# EAGLE schematic IF_TEST_1 (EAGLE 6.5.0)

## Sheet 1 of 6
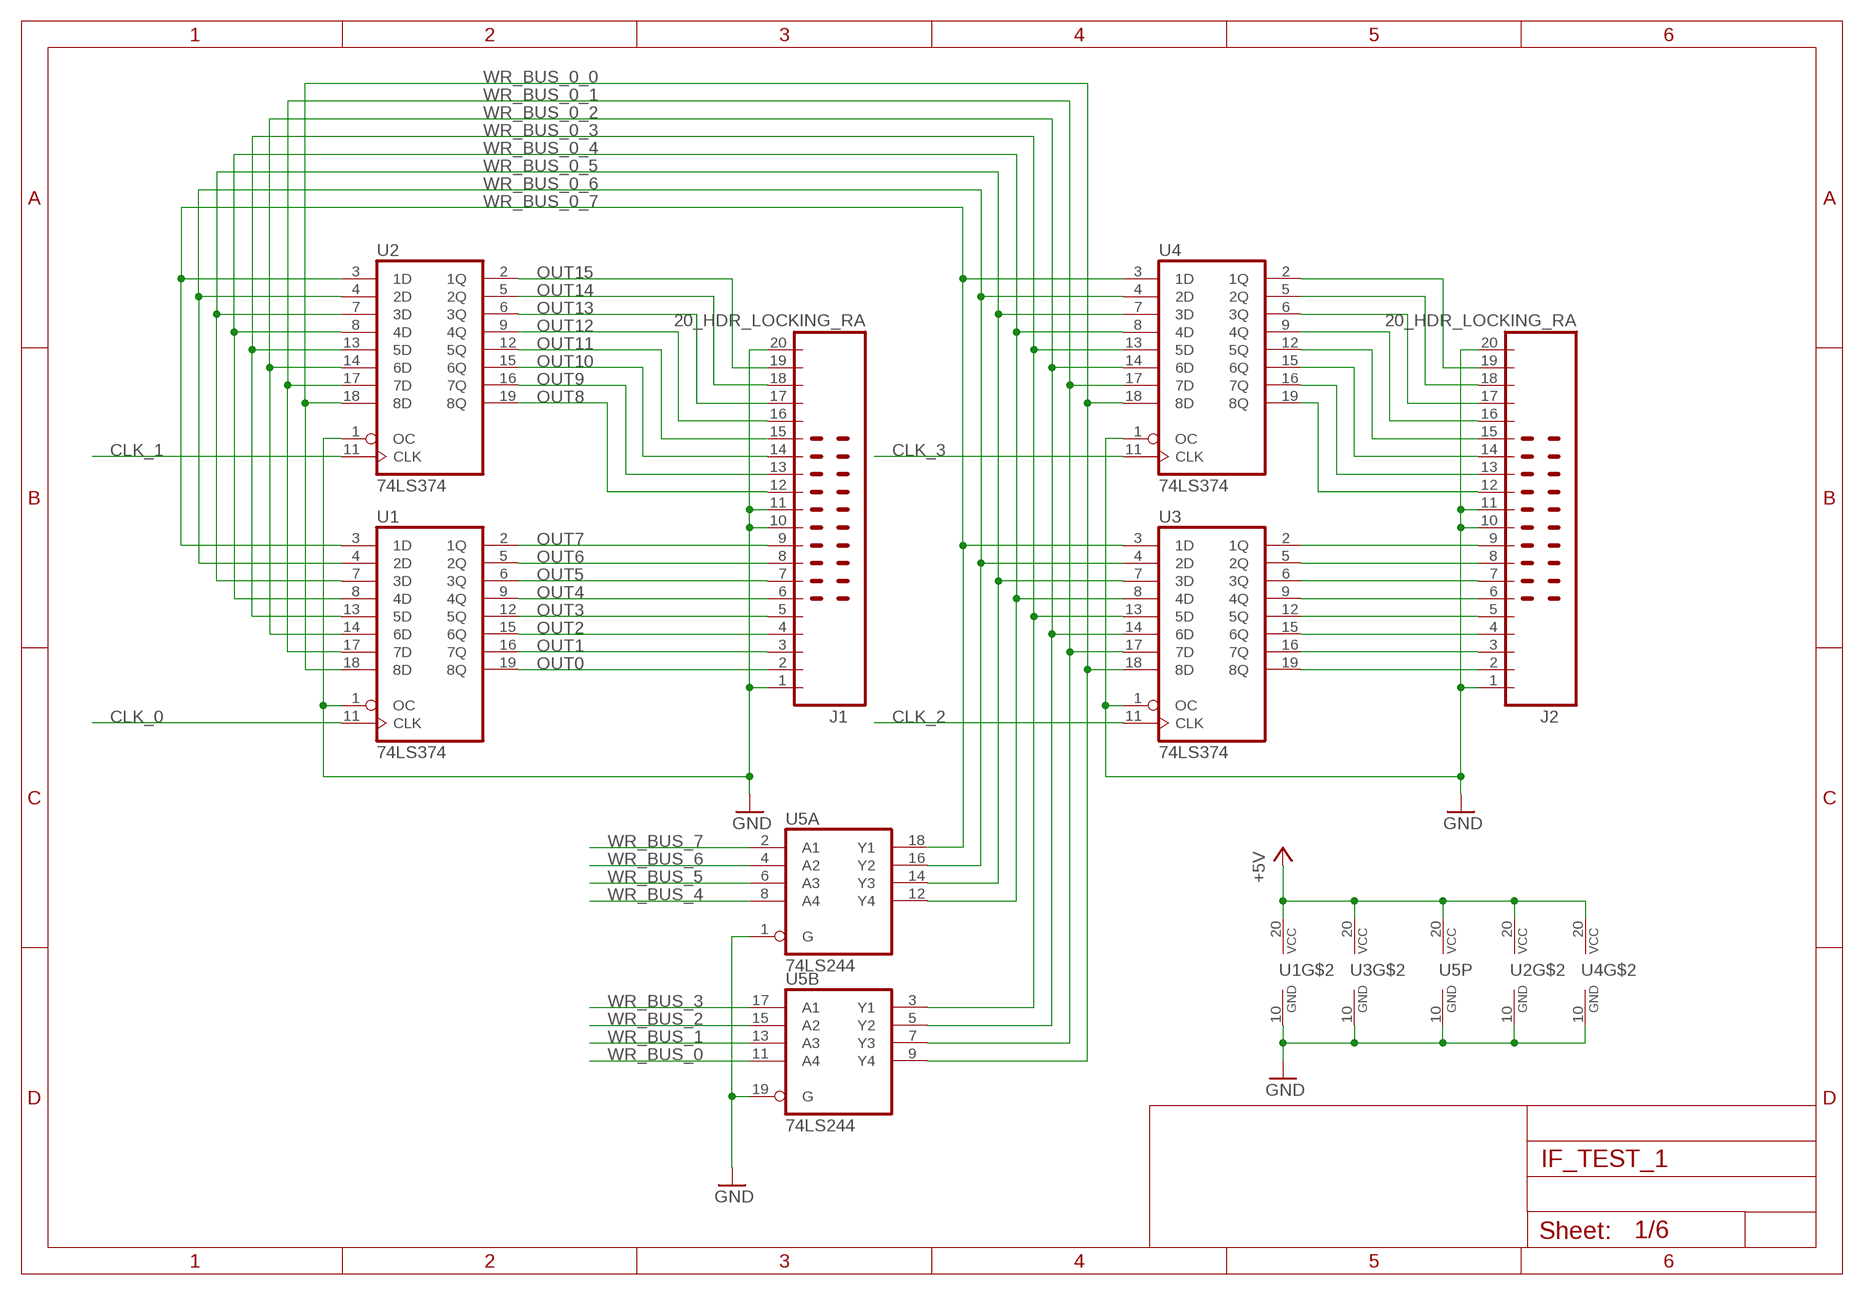
[diagram p0: schematic, sheet 1]

### Parts
J1  20_HDR_LOCKING_RA  [20_HDR_LOCKING_RA]
J2  20_HDR_LOCKING_RA  [20_HDR_LOCKING_RA]
U1  74LS374  [DIP20]
U2  74LS374  [DIP20]
U3  74LS374  [DIP20]
U4  74LS374  [DIP20]
U5  74LS244  [DIP20]

### Nets
+5V: U1.20(VCC) U2.20(VCC) U3.20(VCC) U4.20(VCC) U5.20(P:VCC) ; also sheet 2,3,4,5,6
CLK_0: U1.11(CLK) ; also sheet 5
CLK_1: U2.11(CLK) ; also sheet 5
CLK_2: U3.11(CLK) ; also sheet 5
CLK_3: U4.11(CLK) ; also sheet 5
GND: J1.1 J1.10 J1.11 J1.20 J2.1 J2.10 J2.11 J2.20 U1.1(OC) U1.10(GND) U2.1(OC) U2.10(GND) U3.1(OC) U3.10(GND) U4.1(OC) U4.10(GND) U5.1(A:G) U5.10(P:GND) U5.19(B:G) ; also sheet 2,3,4,5,6
N$1: J2.2 U3.19(8Q)
N$18: J2.3 U3.16(7Q)
N$19: J2.4 U3.15(6Q)
N$20: J2.5 U3.12(5Q)
N$21: J2.6 U3.9(4Q)
N$22: J2.7 U3.6(3Q)
N$23: J2.8 U3.5(2Q)
N$24: J2.9 U3.2(1Q)
N$27: J2.12 U4.19(8Q)
N$28: J2.13 U4.16(7Q)
N$29: J2.14 U4.15(6Q)
N$30: J2.15 U4.12(5Q)
N$31: J2.16 U4.9(4Q)
N$32: J2.17 U4.6(3Q)
N$33: J2.18 U4.5(2Q)
N$34: J2.19 U4.2(1Q)
OUT0: J1.2 U1.19(8Q)
OUT1: J1.3 U1.16(7Q)
OUT2: J1.4 U1.15(6Q)
OUT3: J1.5 U1.12(5Q)
OUT4: J1.6 U1.9(4Q)
OUT5: J1.7 U1.6(3Q)
OUT6: J1.8 U1.5(2Q)
OUT7: J1.9 U1.2(1Q)
OUT8: J1.12 U2.19(8Q)
OUT9: J1.13 U2.16(7Q)
OUT10: J1.14 U2.15(6Q)
OUT11: J1.15 U2.12(5Q)
OUT12: J1.16 U2.9(4Q)
OUT13: J1.17 U2.6(3Q)
OUT14: J1.18 U2.5(2Q)
OUT15: J1.19 U2.2(1Q)
WR_BUS_0: U5.11(B:A4) ; also sheet 4,6
WR_BUS_0_0: U1.18(8D) U2.18(8D) U3.18(8D) U4.18(8D) U5.9(B:Y4) ; also sheet 2
WR_BUS_0_1: U1.17(7D) U2.17(7D) U3.17(7D) U4.17(7D) U5.7(B:Y3) ; also sheet 2
WR_BUS_0_2: U1.14(6D) U2.14(6D) U3.14(6D) U4.14(6D) U5.5(B:Y2) ; also sheet 2
WR_BUS_0_3: U1.13(5D) U2.13(5D) U3.13(5D) U4.13(5D) U5.3(B:Y1) ; also sheet 2
WR_BUS_0_4: U1.8(4D) U2.8(4D) U3.8(4D) U4.8(4D) U5.12(A:Y4) ; also sheet 2
WR_BUS_0_5: U1.7(3D) U2.7(3D) U3.7(3D) U4.7(3D) U5.14(A:Y3) ; also sheet 2
WR_BUS_0_6: U1.4(2D) U2.4(2D) U3.4(2D) U4.4(2D) U5.16(A:Y2) ; also sheet 2
WR_BUS_0_7: U1.3(1D) U2.3(1D) U3.3(1D) U4.3(1D) U5.18(A:Y1) ; also sheet 2
WR_BUS_1: U5.13(B:A3) ; also sheet 4,6
WR_BUS_2: U5.15(B:A2) ; also sheet 4,6
WR_BUS_3: U5.17(B:A1) ; also sheet 4,6
WR_BUS_4: U5.8(A:A4) ; also sheet 4,6
WR_BUS_5: U5.6(A:A3) ; also sheet 4,6
WR_BUS_6: U5.4(A:A2) ; also sheet 4,6
WR_BUS_7: U5.2(A:A1) ; also sheet 4,6

## Sheet 2 of 6
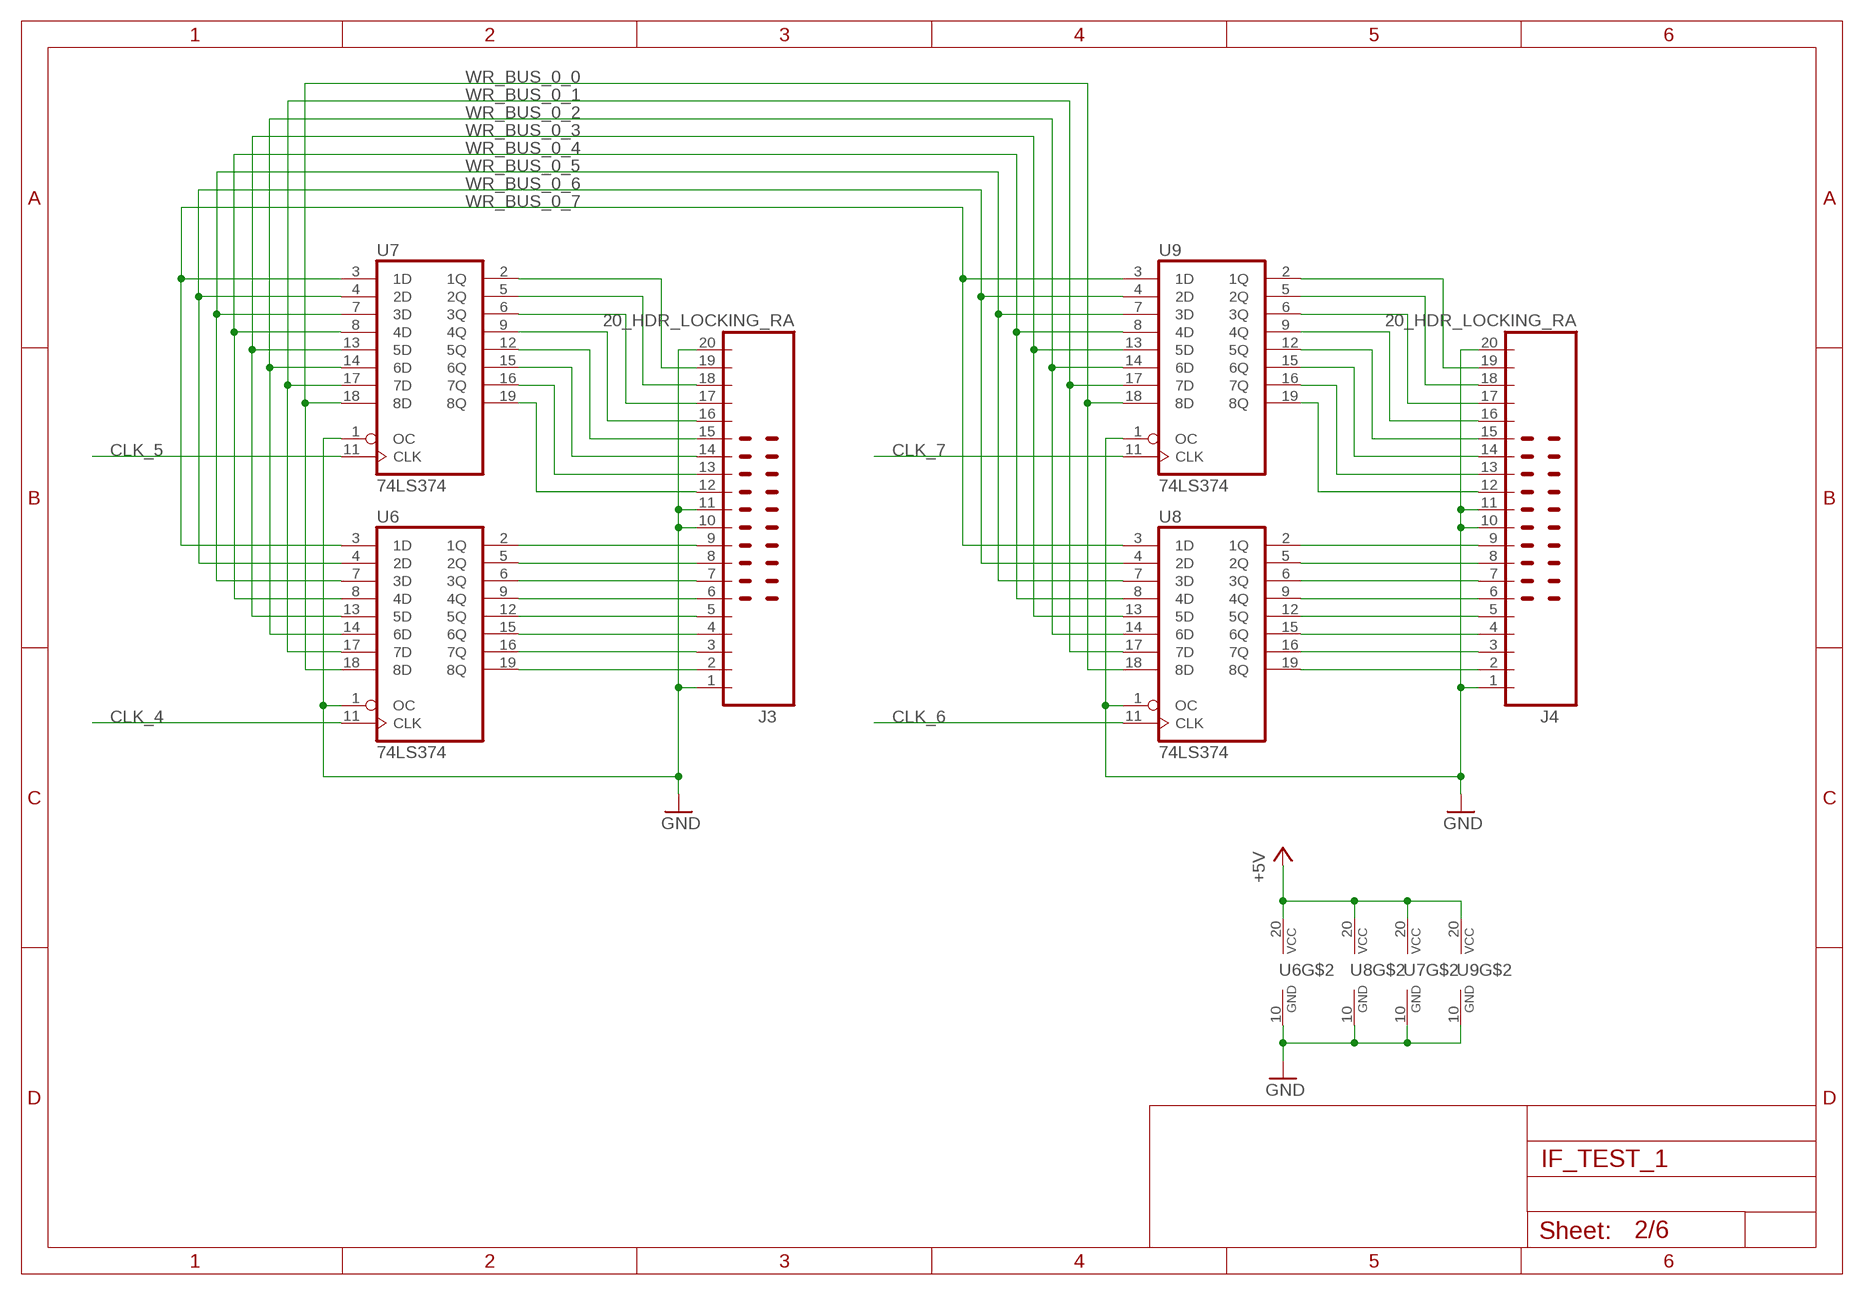
[diagram p1: schematic, sheet 2]

### Parts
J3  20_HDR_LOCKING_RA  [20_HDR_LOCKING_RA]
J4  20_HDR_LOCKING_RA  [20_HDR_LOCKING_RA]
U6  74LS374  [DIP20]
U7  74LS374  [DIP20]
U8  74LS374  [DIP20]
U9  74LS374  [DIP20]

### Nets
+5V: U6.20(VCC) U7.20(VCC) U8.20(VCC) U9.20(VCC) ; also sheet 1,3,4,5,6
CLK_4: U6.11(CLK) ; also sheet 5
CLK_5: U7.11(CLK) ; also sheet 5
CLK_6: U8.11(CLK) ; also sheet 5
CLK_7: U9.11(CLK) ; also sheet 5
GND: J3.1 J3.10 J3.11 J3.20 J4.1 J4.10 J4.11 J4.20 U6.1(OC) U6.10(GND) U7.1(OC) U7.10(GND) U8.1(OC) U8.10(GND) U9.1(OC) U9.10(GND) ; also sheet 1,3,4,5,6
N$25: J3.2 U6.19(8Q)
N$26: J3.3 U6.16(7Q)
N$35: J3.4 U6.15(6Q)
N$36: J3.5 U6.12(5Q)
N$37: J3.6 U6.9(4Q)
N$38: J3.7 U6.6(3Q)
N$39: J3.8 U6.5(2Q)
N$40: J3.9 U6.2(1Q)
N$41: J3.12 U7.19(8Q)
N$42: J3.13 U7.16(7Q)
N$43: J3.14 U7.15(6Q)
N$44: J3.15 U7.12(5Q)
N$45: J3.16 U7.9(4Q)
N$46: J3.17 U7.6(3Q)
N$47: J3.18 U7.5(2Q)
N$48: J3.19 U7.2(1Q)
N$49: J4.2 U8.19(8Q)
N$50: J4.3 U8.16(7Q)
N$51: J4.4 U8.15(6Q)
N$52: J4.5 U8.12(5Q)
N$53: J4.6 U8.9(4Q)
N$54: J4.7 U8.6(3Q)
N$55: J4.8 U8.5(2Q)
N$56: J4.9 U8.2(1Q)
N$57: J4.12 U9.19(8Q)
N$58: J4.13 U9.16(7Q)
N$59: J4.14 U9.15(6Q)
N$60: J4.15 U9.12(5Q)
N$61: J4.16 U9.9(4Q)
N$62: J4.17 U9.6(3Q)
N$63: J4.18 U9.5(2Q)
N$64: J4.19 U9.2(1Q)
WR_BUS_0_0: U6.18(8D) U7.18(8D) U8.18(8D) U9.18(8D) ; also sheet 1
WR_BUS_0_1: U6.17(7D) U7.17(7D) U8.17(7D) U9.17(7D) ; also sheet 1
WR_BUS_0_2: U6.14(6D) U7.14(6D) U8.14(6D) U9.14(6D) ; also sheet 1
WR_BUS_0_3: U6.13(5D) U7.13(5D) U8.13(5D) U9.13(5D) ; also sheet 1
WR_BUS_0_4: U6.8(4D) U7.8(4D) U8.8(4D) U9.8(4D) ; also sheet 1
WR_BUS_0_5: U6.7(3D) U7.7(3D) U8.7(3D) U9.7(3D) ; also sheet 1
WR_BUS_0_6: U6.4(2D) U7.4(2D) U8.4(2D) U9.4(2D) ; also sheet 1
WR_BUS_0_7: U6.3(1D) U7.3(1D) U8.3(1D) U9.3(1D) ; also sheet 1

## Sheet 3 of 6
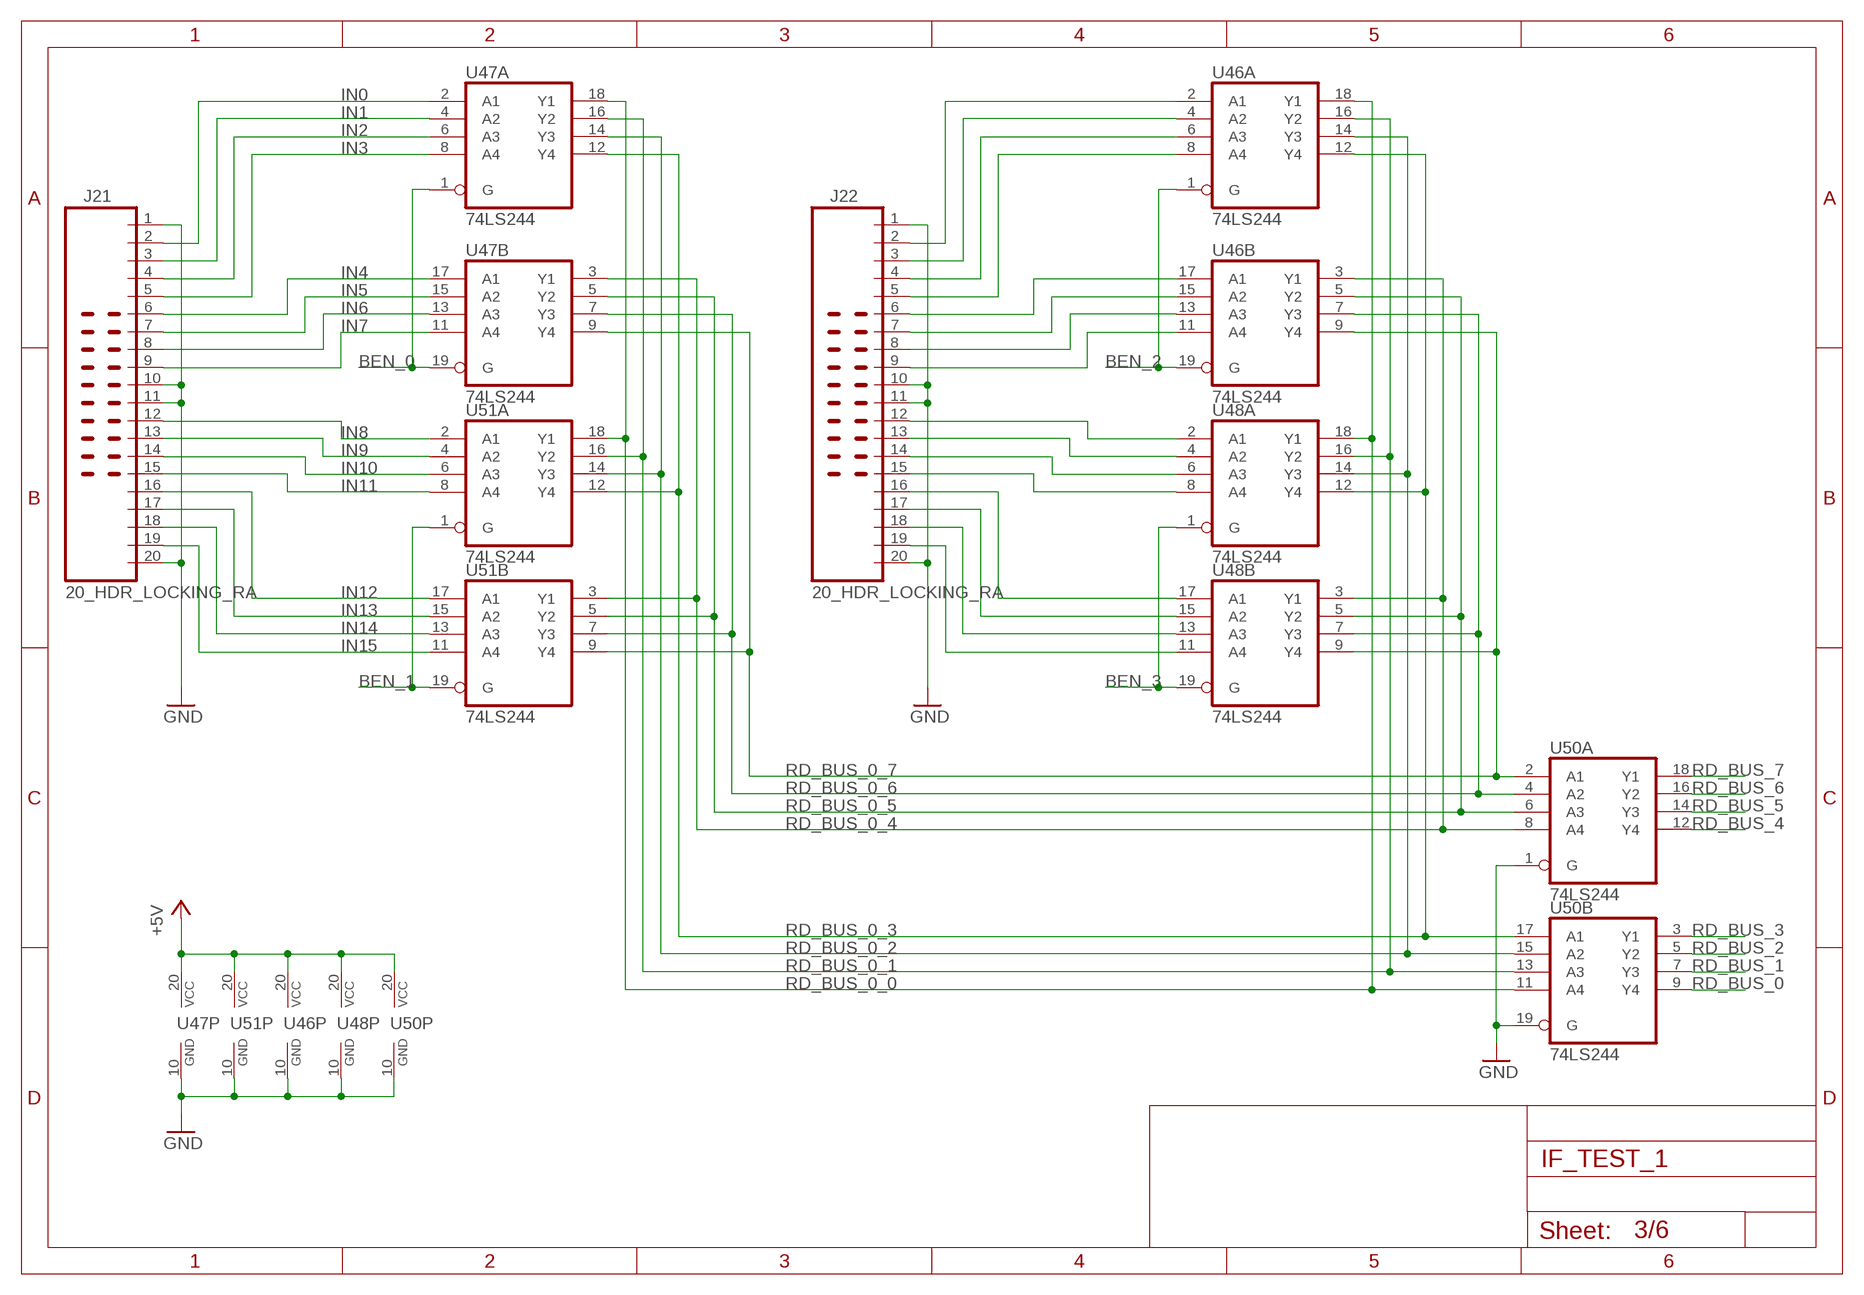
[diagram p2: schematic, sheet 3]

### Parts
J21  20_HDR_LOCKING_RA  [20_HDR_LOCKING_RA]
J22  20_HDR_LOCKING_RA  [20_HDR_LOCKING_RA]
U46  74LS244  [DIP20]
U47  74LS244  [DIP20]
U48  74LS244  [DIP20]
U50  74LS244  [DIP20]
U51  74LS244  [DIP20]

### Nets
+5V: U46.20(P:VCC) U47.20(P:VCC) U48.20(P:VCC) U50.20(P:VCC) U51.20(P:VCC) ; also sheet 1,2,4,5,6
BEN_0: U47.1(A:G) U47.19(B:G) ; also sheet 5
BEN_1: U51.1(A:G) U51.19(B:G) ; also sheet 5
BEN_2: U46.1(A:G) U46.19(B:G) ; also sheet 5
BEN_3: U48.1(A:G) U48.19(B:G) ; also sheet 5
GND: J21.1 J21.10 J21.11 J21.20 J22.1 J22.10 J22.11 J22.20 U46.10(P:GND) U47.10(P:GND) U48.10(P:GND) U50.1(A:G) U50.10(P:GND) U50.19(B:G) U51.10(P:GND) ; also sheet 1,2,4,5,6
IN0: J21.2 U47.2(A:A1)
IN1: J21.3 U47.4(A:A2)
IN2: J21.4 U47.6(A:A3)
IN3: J21.5 U47.8(A:A4)
IN4: J21.6 U47.17(B:A1)
IN5: J21.7 U47.15(B:A2)
IN6: J21.8 U47.13(B:A3)
IN7: J21.9 U47.11(B:A4)
IN8: J21.12 U51.2(A:A1)
IN9: J21.13 U51.4(A:A2)
IN10: J21.14 U51.6(A:A3)
IN11: J21.15 U51.8(A:A4)
IN12: J21.16 U51.17(B:A1)
IN13: J21.17 U51.15(B:A2)
IN14: J21.18 U51.13(B:A3)
IN15: J21.19 U51.11(B:A4)
N$321: J22.2 U46.2(A:A1)
N$330: J22.3 U46.4(A:A2)
N$331: J22.4 U46.6(A:A3)
N$336: J22.5 U46.8(A:A4)
N$345: J22.6 U46.17(B:A1)
N$346: J22.7 U46.15(B:A2)
N$347: J22.8 U46.13(B:A3)
N$348: J22.9 U46.11(B:A4)
N$349: J22.12 U48.2(A:A1)
N$350: J22.13 U48.4(A:A2)
N$351: J22.14 U48.6(A:A3)
N$352: J22.15 U48.8(A:A4)
N$357: J22.19 U48.11(B:A4)
N$358: J22.18 U48.13(B:A3)
N$359: J22.17 U48.15(B:A2)
N$360: J22.16 U48.17(B:A1)
RD_BUS_0: U50.9(B:Y4) ; also sheet 4
RD_BUS_0_0: U46.18(A:Y1) U47.18(A:Y1) U48.18(A:Y1) U50.11(B:A4) U51.18(A:Y1) ; also sheet 6
RD_BUS_0_1: U46.16(A:Y2) U47.16(A:Y2) U48.16(A:Y2) U50.13(B:A3) U51.16(A:Y2) ; also sheet 6
RD_BUS_0_2: U46.14(A:Y3) U47.14(A:Y3) U48.14(A:Y3) U50.15(B:A2) U51.14(A:Y3) ; also sheet 6
RD_BUS_0_3: U46.12(A:Y4) U47.12(A:Y4) U48.12(A:Y4) U50.17(B:A1) U51.12(A:Y4) ; also sheet 6
RD_BUS_0_4: U46.3(B:Y1) U47.3(B:Y1) U48.3(B:Y1) U50.8(A:A4) U51.3(B:Y1) ; also sheet 6
RD_BUS_0_5: U46.5(B:Y2) U47.5(B:Y2) U48.5(B:Y2) U50.6(A:A3) U51.5(B:Y2) ; also sheet 6
RD_BUS_0_6: U46.7(B:Y3) U47.7(B:Y3) U48.7(B:Y3) U50.4(A:A2) U51.7(B:Y3) ; also sheet 6
RD_BUS_0_7: U46.9(B:Y4) U47.9(B:Y4) U48.9(B:Y4) U50.2(A:A1) U51.9(B:Y4) ; also sheet 6
RD_BUS_1: U50.7(B:Y3) ; also sheet 4
RD_BUS_2: U50.5(B:Y2) ; also sheet 4
RD_BUS_3: U50.3(B:Y1) ; also sheet 4
RD_BUS_4: U50.12(A:Y4) ; also sheet 4
RD_BUS_5: U50.14(A:Y3) ; also sheet 4
RD_BUS_6: U50.16(A:Y2) ; also sheet 4
RD_BUS_7: U50.18(A:Y1) ; also sheet 4

## Sheet 4 of 6
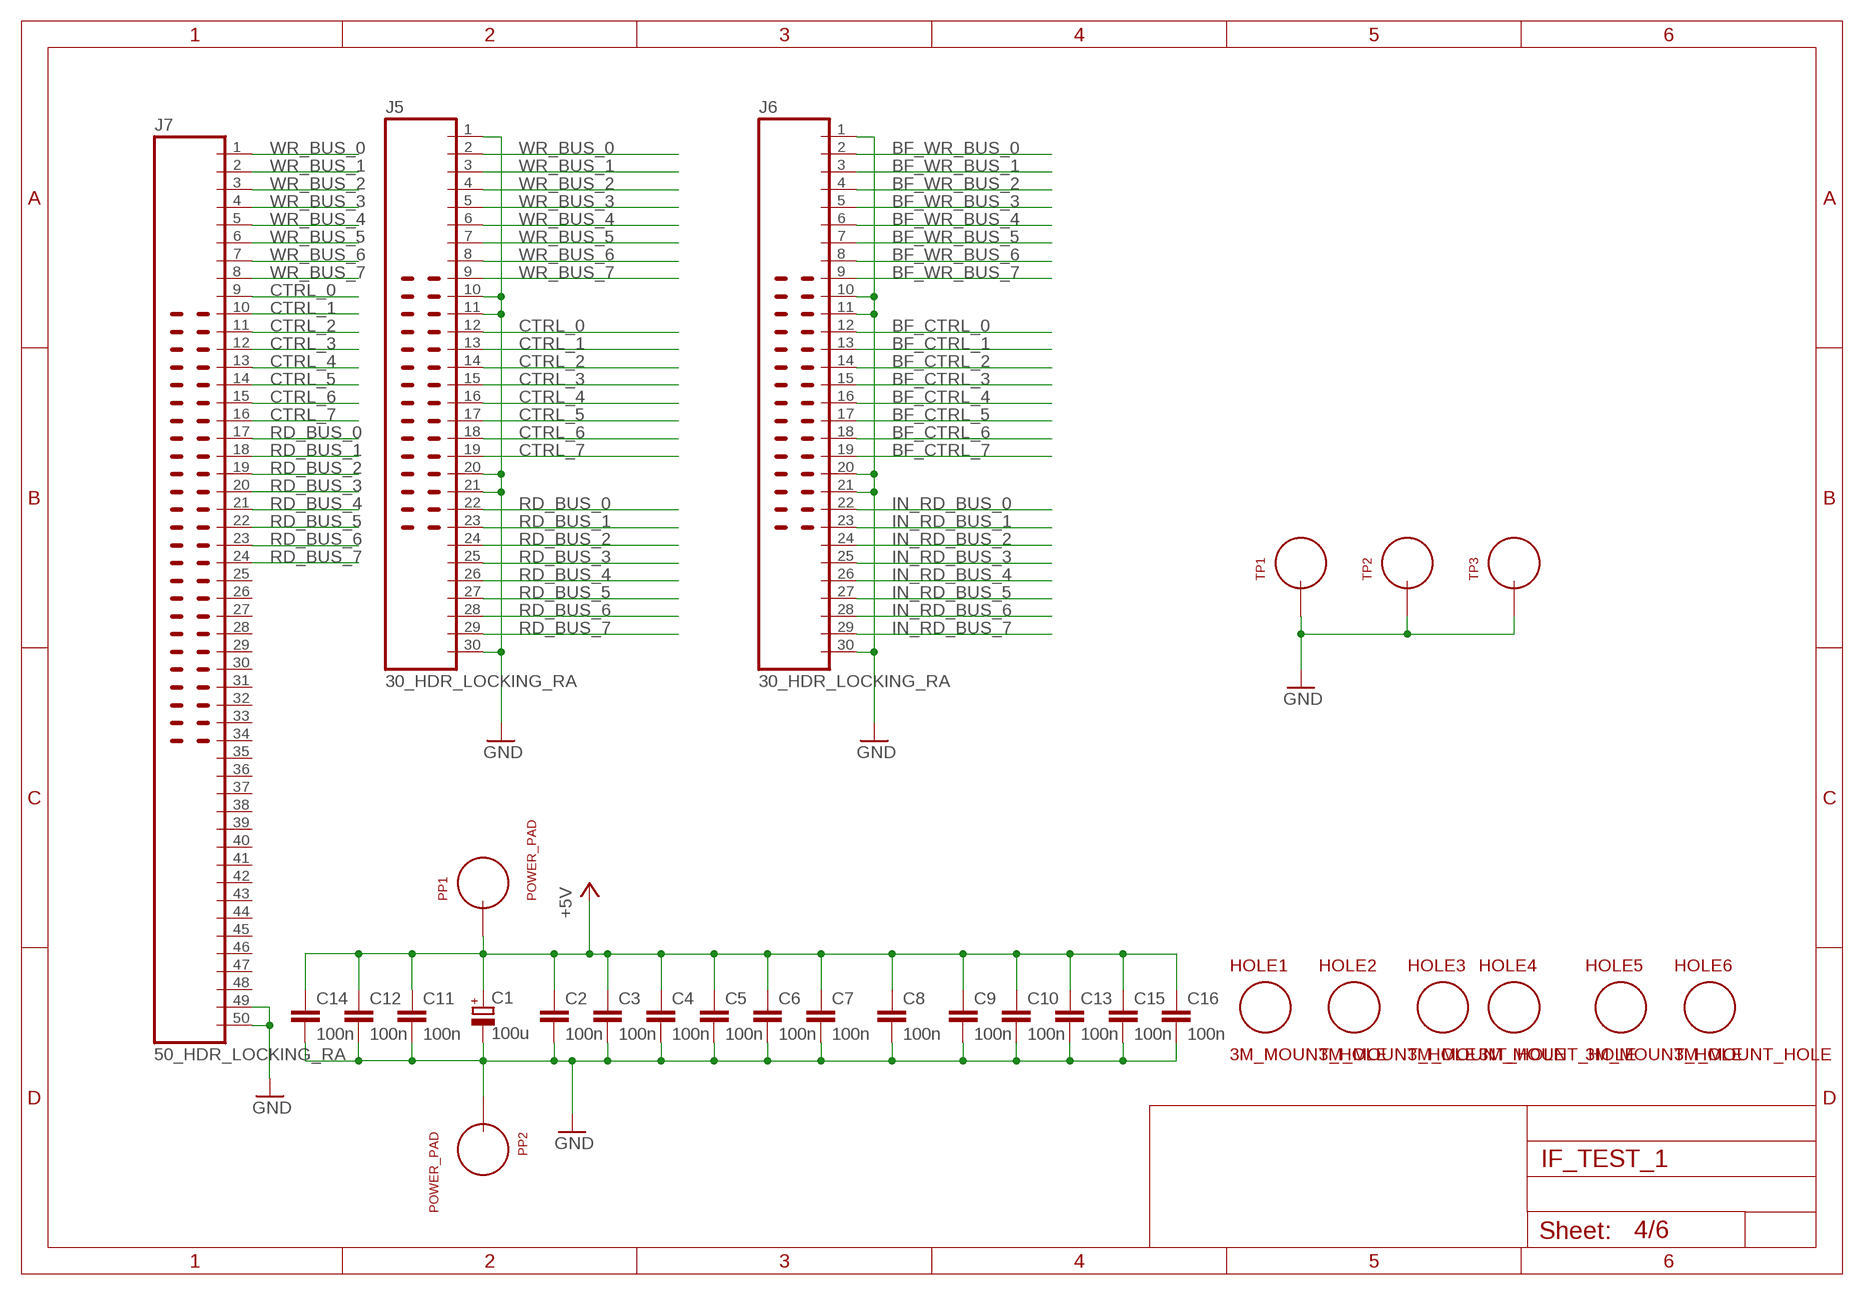
[diagram p3: schematic, sheet 4]

### Parts
C1  100u  POLARISED_CAP_2P5_6P3MM  [POLARISED_CAP_2P5_6P3MM]
C2  100n  C_P2INCH  [CAP_P2INCH]
C3  100n  C_P2INCH  [CAP_P2INCH]
C4  100n  C_P2INCH  [CAP_P2INCH]
C5  100n  C_P2INCH  [CAP_P2INCH]
C6  100n  C_P2INCH  [CAP_P2INCH]
C7  100n  C_P2INCH  [CAP_P2INCH]
C8  100n  C_P2INCH  [CAP_P2INCH]
C9  100n  C_P2INCH  [CAP_P2INCH]
C10  100n  C_P2INCH  [CAP_P2INCH]
C11  100n  C_P2INCH  [CAP_P2INCH]
C12  100n  C_P2INCH  [CAP_P2INCH]
C13  100n  C_P2INCH  [CAP_P2INCH]
C14  100n  C_P2INCH  [CAP_P2INCH]
C15  100n  C_P2INCH  [CAP_P2INCH]
C16  100n  C_P2INCH  [CAP_P2INCH]
HOLE1  3M_MOUNT_HOLE  [3M_HOLE]
HOLE2  3M_MOUNT_HOLE  [3M_HOLE]
HOLE3  3M_MOUNT_HOLE  [3M_HOLE]
HOLE4  3M_MOUNT_HOLE  [3M_HOLE]
HOLE5  3M_MOUNT_HOLE  [3M_HOLE]
HOLE6  3M_MOUNT_HOLE  [3M_HOLE]
J5  30_HDR_LOCKING_RA  [30_HDR_LOCKING_RA]
J6  30_HDR_LOCKING_RA  [30_HDR_LOCKING_RA]
J7  50_HDR_LOCKING_RA  [50_HDR_LOCKING_RA]
PP1  POWER_PAD  [POWER_PAD]
PP2  POWER_PAD  [POWER_PAD]
TP1  TEST_LOOP  [TEST_LOOP]
TP2  TEST_LOOP  [TEST_LOOP]
TP3  TEST_LOOP  [TEST_LOOP]

### Nets
+5V: C1.A C2.1 C3.1 C4.1 C5.1 C6.1 C7.1 C8.1 C9.1 C10.1 C11.1 C12.1 C13.1 C14.1 C15.1 C16.1 PP1.1 ; also sheet 1,2,3,5,6
BF_CTRL_0: J6.12 ; also sheet 6
BF_CTRL_1: J6.13 ; also sheet 6
BF_CTRL_2: J6.14 ; also sheet 6
BF_CTRL_3: J6.15 ; also sheet 6
BF_CTRL_4: J6.16 ; also sheet 6
BF_CTRL_5: J6.17 ; also sheet 6
BF_CTRL_6: J6.18 ; also sheet 6
BF_CTRL_7: J6.19 ; also sheet 6
BF_WR_BUS_0: J6.2 ; also sheet 6
BF_WR_BUS_1: J6.3 ; also sheet 6
BF_WR_BUS_2: J6.4 ; also sheet 6
BF_WR_BUS_3: J6.5 ; also sheet 6
BF_WR_BUS_4: J6.6 ; also sheet 6
BF_WR_BUS_5: J6.7 ; also sheet 6
BF_WR_BUS_6: J6.8 ; also sheet 6
BF_WR_BUS_7: J6.9 ; also sheet 6
CTRL_0: J5.12 J7.9 ; also sheet 5,6
CTRL_1: J5.13 J7.10 ; also sheet 5,6
CTRL_2: J5.14 J7.11 ; also sheet 5,6
CTRL_3: J5.15 J7.12 ; also sheet 5,6
CTRL_4: J5.16 J7.13 ; also sheet 5,6
CTRL_5: J5.17 J7.14 ; also sheet 5,6
CTRL_6: J5.18 J7.15 ; also sheet 5,6
CTRL_7: J5.19 J7.16 ; also sheet 6
GND: C1.K C2.2 C3.2 C4.2 C5.2 C6.2 C7.2 C8.2 C9.2 C10.2 C11.2 C12.2 C13.2 C14.2 C15.2 C16.2 J5.1 J5.10 J5.11 J5.20 J5.21 J5.30 J6.1 J6.10 J6.11 J6.20 J6.21 J6.30 J7.49 J7.50 PP2.1 TP1.P$1 TP2.P$1 TP3.P$1 ; also sheet 1,2,3,5,6
IN_RD_BUS_0: J6.22 ; also sheet 6
IN_RD_BUS_1: J6.23 ; also sheet 6
IN_RD_BUS_2: J6.24 ; also sheet 6
IN_RD_BUS_3: J6.25 ; also sheet 6
IN_RD_BUS_4: J6.26 ; also sheet 6
IN_RD_BUS_5: J6.27 ; also sheet 6
IN_RD_BUS_6: J6.28 ; also sheet 6
IN_RD_BUS_7: J6.29 ; also sheet 6
RD_BUS_0: J5.22 J7.17 ; also sheet 3
RD_BUS_1: J5.23 J7.18 ; also sheet 3
RD_BUS_2: J5.24 J7.19 ; also sheet 3
RD_BUS_3: J5.25 J7.20 ; also sheet 3
RD_BUS_4: J5.26 J7.21 ; also sheet 3
RD_BUS_5: J5.27 J7.22 ; also sheet 3
RD_BUS_6: J5.28 J7.23 ; also sheet 3
RD_BUS_7: J5.29 J7.24 ; also sheet 3
WR_BUS_0: J5.2 J7.1 ; also sheet 1,6
WR_BUS_1: J5.3 J7.2 ; also sheet 1,6
WR_BUS_2: J5.4 J7.3 ; also sheet 1,6
WR_BUS_3: J5.5 J7.4 ; also sheet 1,6
WR_BUS_4: J5.6 J7.5 ; also sheet 1,6
WR_BUS_5: J5.7 J7.6 ; also sheet 1,6
WR_BUS_6: J5.8 J7.7 ; also sheet 1,6
WR_BUS_7: J5.9 J7.8 ; also sheet 1,6
Unconnected: J7.25 J7.26 J7.27 J7.28 J7.29 J7.30 J7.31 J7.32 J7.33 J7.34 J7.35 J7.36 J7.37 J7.38 J7.39 J7.40 J7.41 J7.42 J7.43 J7.44 J7.45 J7.46 J7.47 J7.48

## Sheet 5 of 6
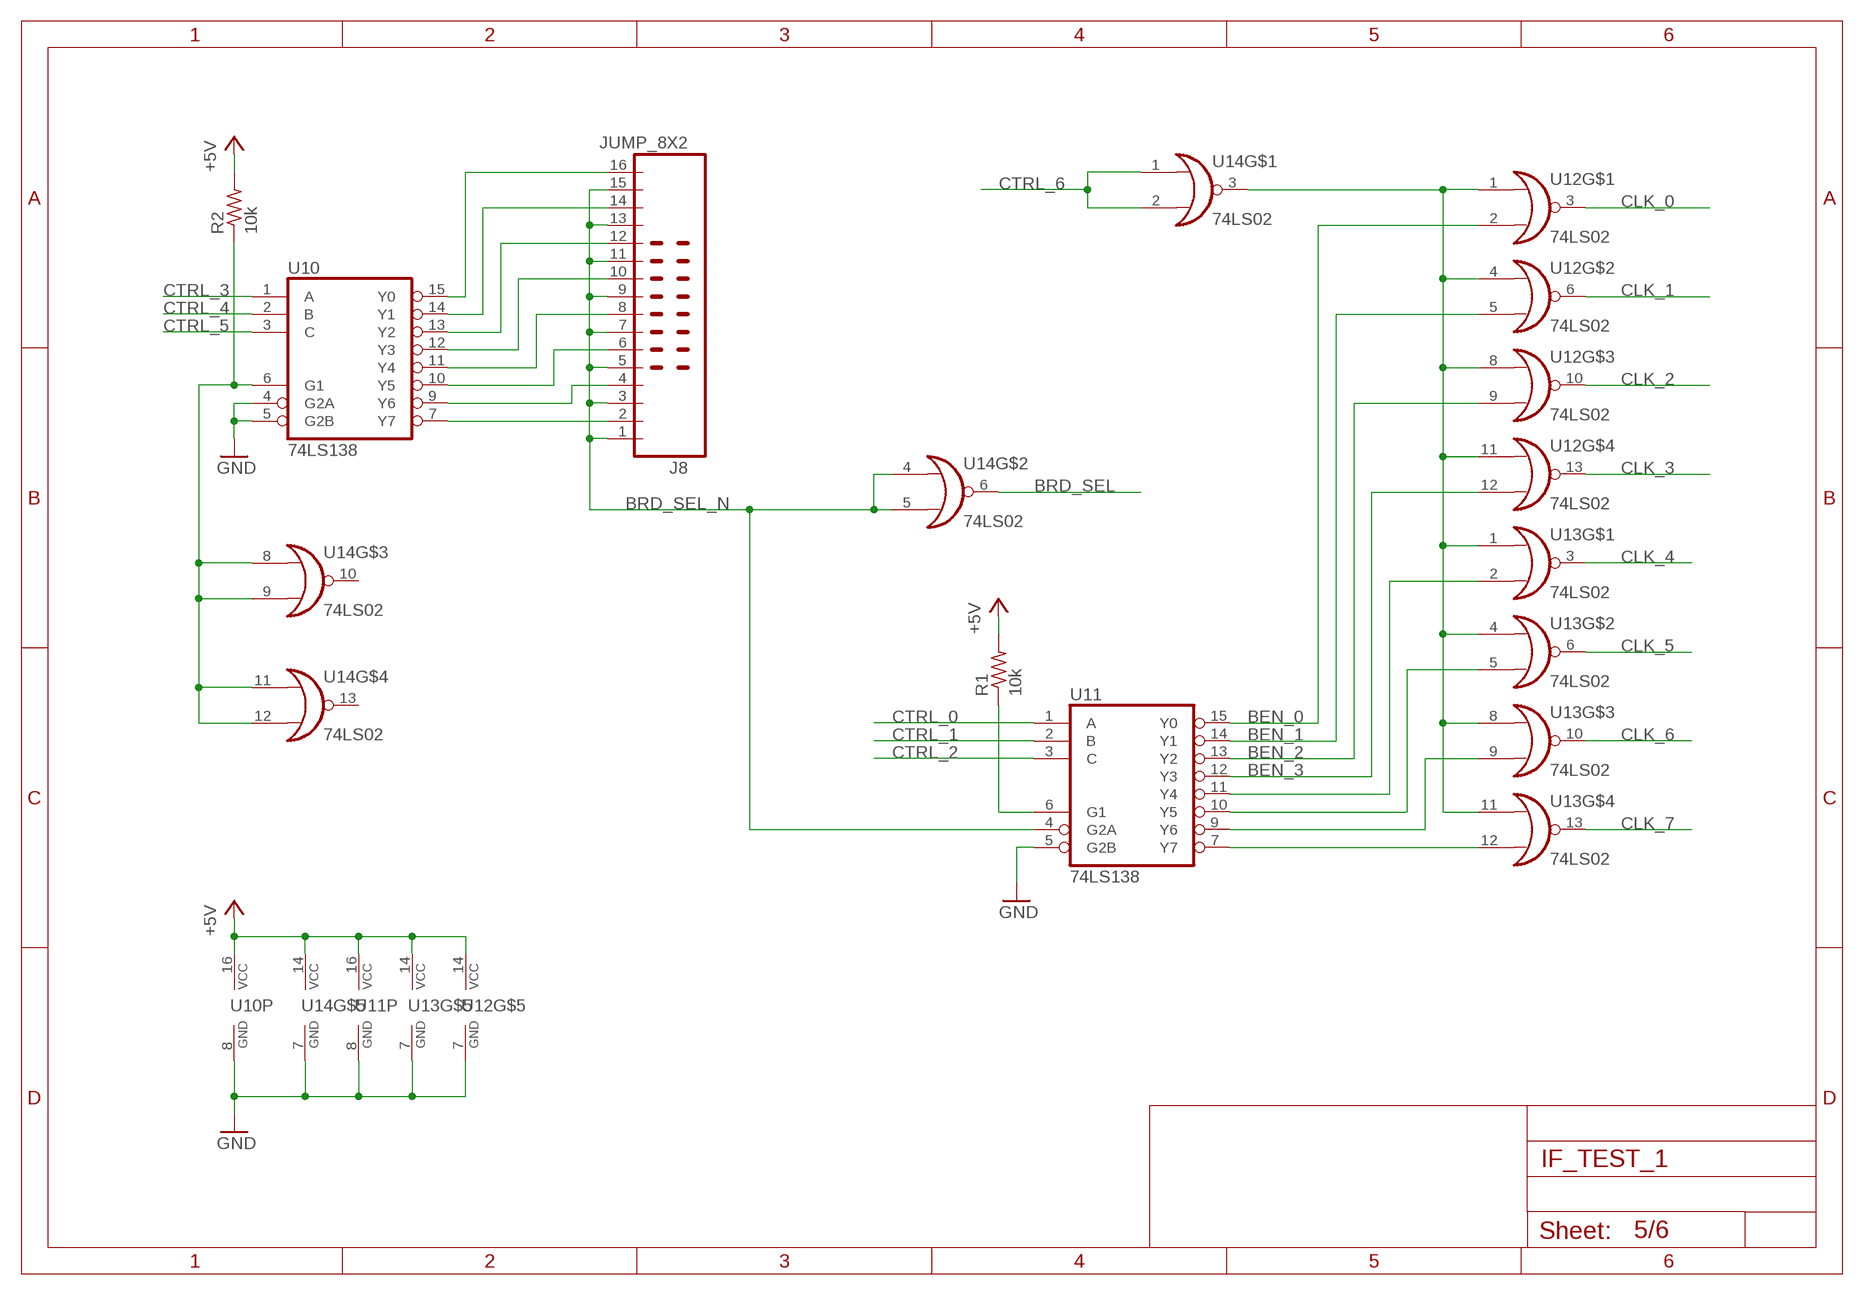
[diagram p4: schematic, sheet 5]

### Parts
J8  JUMP_8X2  [JUMP_8X2]
R1  10k  R_P2INCH  [R_P2INCH]
R2  10k  R_P2INCH  [R_P2INCH]
U10  74LS138  [DIP16]
U11  74LS138  [DIP16]
U12  74LS02  [DIP14]
U13  74LS02  [DIP14]
U14  74LS02  [DIP14]

### Nets
+5V: R1.2 R2.2 U10.16(VCC) U11.16(VCC) U12.14(VCC) U13.14(VCC) U14.14(VCC) ; also sheet 1,2,3,4,6
BEN_0: U11.15(Y0) U12.2(I1) ; also sheet 3
BEN_1: U11.14(Y1) U12.5(I1) ; also sheet 3
BEN_2: U11.13(Y2) U12.9(I1) ; also sheet 3
BEN_3: U11.12(Y3) U12.12(I1) ; also sheet 3
BRD_SEL: U14.6(O) ; also sheet 6
BRD_SEL_N: J8.1 J8.3 J8.5 J8.7 J8.9 J8.11 J8.13 J8.15 U11.4(G2A) U14.4(I0) U14.5(I1)
CLK_0: U12.3(O) ; also sheet 1
CLK_1: U12.6(O) ; also sheet 1
CLK_2: U12.10(O) ; also sheet 1
CLK_3: U12.13(O) ; also sheet 1
CLK_4: U13.3(O) ; also sheet 2
CLK_5: U13.6(O) ; also sheet 2
CLK_6: U13.10(O) ; also sheet 2
CLK_7: U13.13(O) ; also sheet 2
CTRL_0: U11.1(A) ; also sheet 4,6
CTRL_1: U11.2(B) ; also sheet 4,6
CTRL_2: U11.3(C) ; also sheet 4,6
CTRL_3: U10.1(A) ; also sheet 4,6
CTRL_4: U10.2(B) ; also sheet 4,6
CTRL_5: U10.3(C) ; also sheet 4,6
CTRL_6: U14.1(I0) U14.2(I1) ; also sheet 4,6
GND: U10.4(G2A) U10.5(G2B) U10.8(GND) U11.5(G2B) U11.8(GND) U12.7(GND) U13.7(GND) U14.7(GND) ; also sheet 1,2,3,4,6
N$3: J8.2 U10.7(Y7)
N$4: J8.4 U10.9(Y6)
N$5: J8.6 U10.10(Y5)
N$6: J8.8 U10.11(Y4)
N$7: J8.10 U10.12(Y3)
N$8: J8.12 U10.13(Y2)
N$9: J8.14 U10.14(Y1)
N$10: J8.16 U10.15(Y0)
N$13: R2.1 U10.6(G1) U14.8(I0) U14.9(I1) U14.11(I0) U14.12(I1)
N$14: U12.1(I0) U12.4(I0) U12.8(I0) U12.11(I0) U13.1(I0) U13.4(I0) U13.8(I0) U13.11(I0) U14.3(O)
N$71: U11.7(Y7) U13.12(I1)
N$72: U11.9(Y6) U13.9(I1)
N$73: U11.10(Y5) U13.5(I1)
N$74: U11.11(Y4) U13.2(I1)
N$79: R1.1 U11.6(G1)
Unconnected: U14.10(O) U14.13(O)

## Sheet 6 of 6
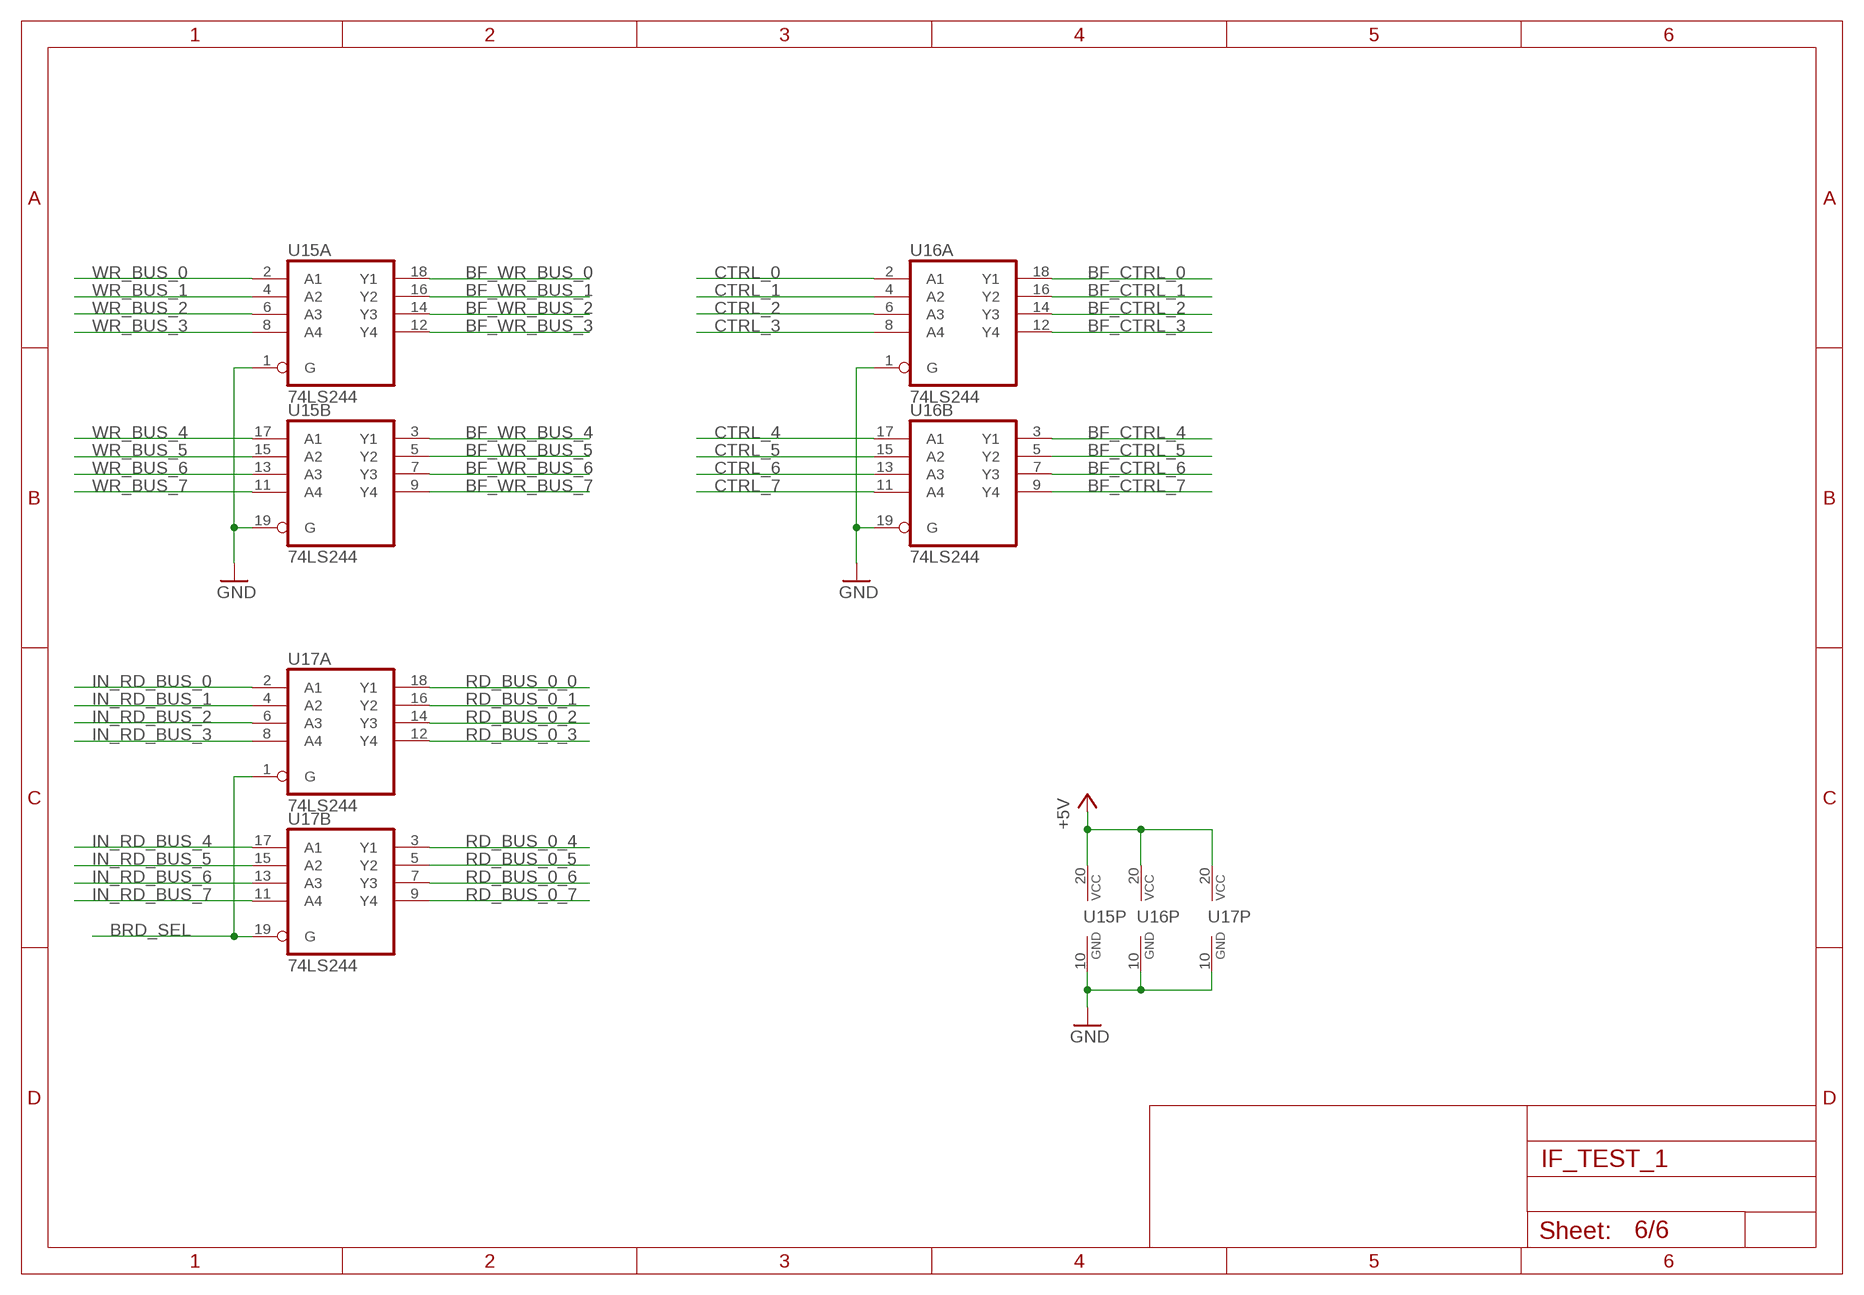
[diagram p5: schematic, sheet 6]

### Parts
U15  74LS244  [DIP20]
U16  74LS244  [DIP20]
U17  74LS244  [DIP20]

### Nets
+5V: U15.20(P:VCC) U16.20(P:VCC) U17.20(P:VCC) ; also sheet 1,2,3,4,5
BF_CTRL_0: U16.18(A:Y1) ; also sheet 4
BF_CTRL_1: U16.16(A:Y2) ; also sheet 4
BF_CTRL_2: U16.14(A:Y3) ; also sheet 4
BF_CTRL_3: U16.12(A:Y4) ; also sheet 4
BF_CTRL_4: U16.3(B:Y1) ; also sheet 4
BF_CTRL_5: U16.5(B:Y2) ; also sheet 4
BF_CTRL_6: U16.7(B:Y3) ; also sheet 4
BF_CTRL_7: U16.9(B:Y4) ; also sheet 4
BF_WR_BUS_0: U15.18(A:Y1) ; also sheet 4
BF_WR_BUS_1: U15.16(A:Y2) ; also sheet 4
BF_WR_BUS_2: U15.14(A:Y3) ; also sheet 4
BF_WR_BUS_3: U15.12(A:Y4) ; also sheet 4
BF_WR_BUS_4: U15.3(B:Y1) ; also sheet 4
BF_WR_BUS_5: U15.5(B:Y2) ; also sheet 4
BF_WR_BUS_6: U15.7(B:Y3) ; also sheet 4
BF_WR_BUS_7: U15.9(B:Y4) ; also sheet 4
BRD_SEL: U17.1(A:G) U17.19(B:G) ; also sheet 5
CTRL_0: U16.2(A:A1) ; also sheet 4,5
CTRL_1: U16.4(A:A2) ; also sheet 4,5
CTRL_2: U16.6(A:A3) ; also sheet 4,5
CTRL_3: U16.8(A:A4) ; also sheet 4,5
CTRL_4: U16.17(B:A1) ; also sheet 4,5
CTRL_5: U16.15(B:A2) ; also sheet 4,5
CTRL_6: U16.13(B:A3) ; also sheet 4,5
CTRL_7: U16.11(B:A4) ; also sheet 4
GND: U15.1(A:G) U15.10(P:GND) U15.19(B:G) U16.1(A:G) U16.10(P:GND) U16.19(B:G) U17.10(P:GND) ; also sheet 1,2,3,4,5
IN_RD_BUS_0: U17.2(A:A1) ; also sheet 4
IN_RD_BUS_1: U17.4(A:A2) ; also sheet 4
IN_RD_BUS_2: U17.6(A:A3) ; also sheet 4
IN_RD_BUS_3: U17.8(A:A4) ; also sheet 4
IN_RD_BUS_4: U17.17(B:A1) ; also sheet 4
IN_RD_BUS_5: U17.15(B:A2) ; also sheet 4
IN_RD_BUS_6: U17.13(B:A3) ; also sheet 4
IN_RD_BUS_7: U17.11(B:A4) ; also sheet 4
RD_BUS_0_0: U17.18(A:Y1) ; also sheet 3
RD_BUS_0_1: U17.16(A:Y2) ; also sheet 3
RD_BUS_0_2: U17.14(A:Y3) ; also sheet 3
RD_BUS_0_3: U17.12(A:Y4) ; also sheet 3
RD_BUS_0_4: U17.3(B:Y1) ; also sheet 3
RD_BUS_0_5: U17.5(B:Y2) ; also sheet 3
RD_BUS_0_6: U17.7(B:Y3) ; also sheet 3
RD_BUS_0_7: U17.9(B:Y4) ; also sheet 3
WR_BUS_0: U15.2(A:A1) ; also sheet 1,4
WR_BUS_1: U15.4(A:A2) ; also sheet 1,4
WR_BUS_2: U15.6(A:A3) ; also sheet 1,4
WR_BUS_3: U15.8(A:A4) ; also sheet 1,4
WR_BUS_4: U15.17(B:A1) ; also sheet 1,4
WR_BUS_5: U15.15(B:A2) ; also sheet 1,4
WR_BUS_6: U15.13(B:A3) ; also sheet 1,4
WR_BUS_7: U15.11(B:A4) ; also sheet 1,4

## Library data of the parts
C1 = MyLib:POLARISED_CAP_2P5_6P3MM
C2-C16 = MyLib:C_P2INCH
HOLE1-HOLE6 = MyLib:3M_MOUNT_HOLE
J1-J4 J21 J22 = MyLib:20_HDR_LOCKING_RA
J5 J6 = MyLib:30_HDR_LOCKING_RA
J7 = MyLib:50_HDR_LOCKING_RA
J8 = MyLib:JUMP_8X2
PP1 PP2 = MyLib:POWER_PAD
R1 R2 = MyLib:R_P2INCH
TP1-TP3 = MyLib:TEST_LOOP
U1-U4 U6-U9 = MyLib:74LS374
U5 U15-U17 U46-U48 U50 U51 = MyLib:74LS244
U10 U11 = MyLib:74LS138
U12-U14 = MyLib:74LS02